# Altium schematic sheet Shutdown_2019_v1.1_4.SchDoc: Shutdown_2019_v1.1
size 453 x 301 mm; Date: 1/4/2019 10:42:19 PM; SheetNumber: 5; GateName_1: G$1; SymbolName_1: FRAME_B_L; LibraryName: frames; DeviceSetName: FRAME_B_L; GateName_2: G$2; SymbolName_2: DOCFIELD
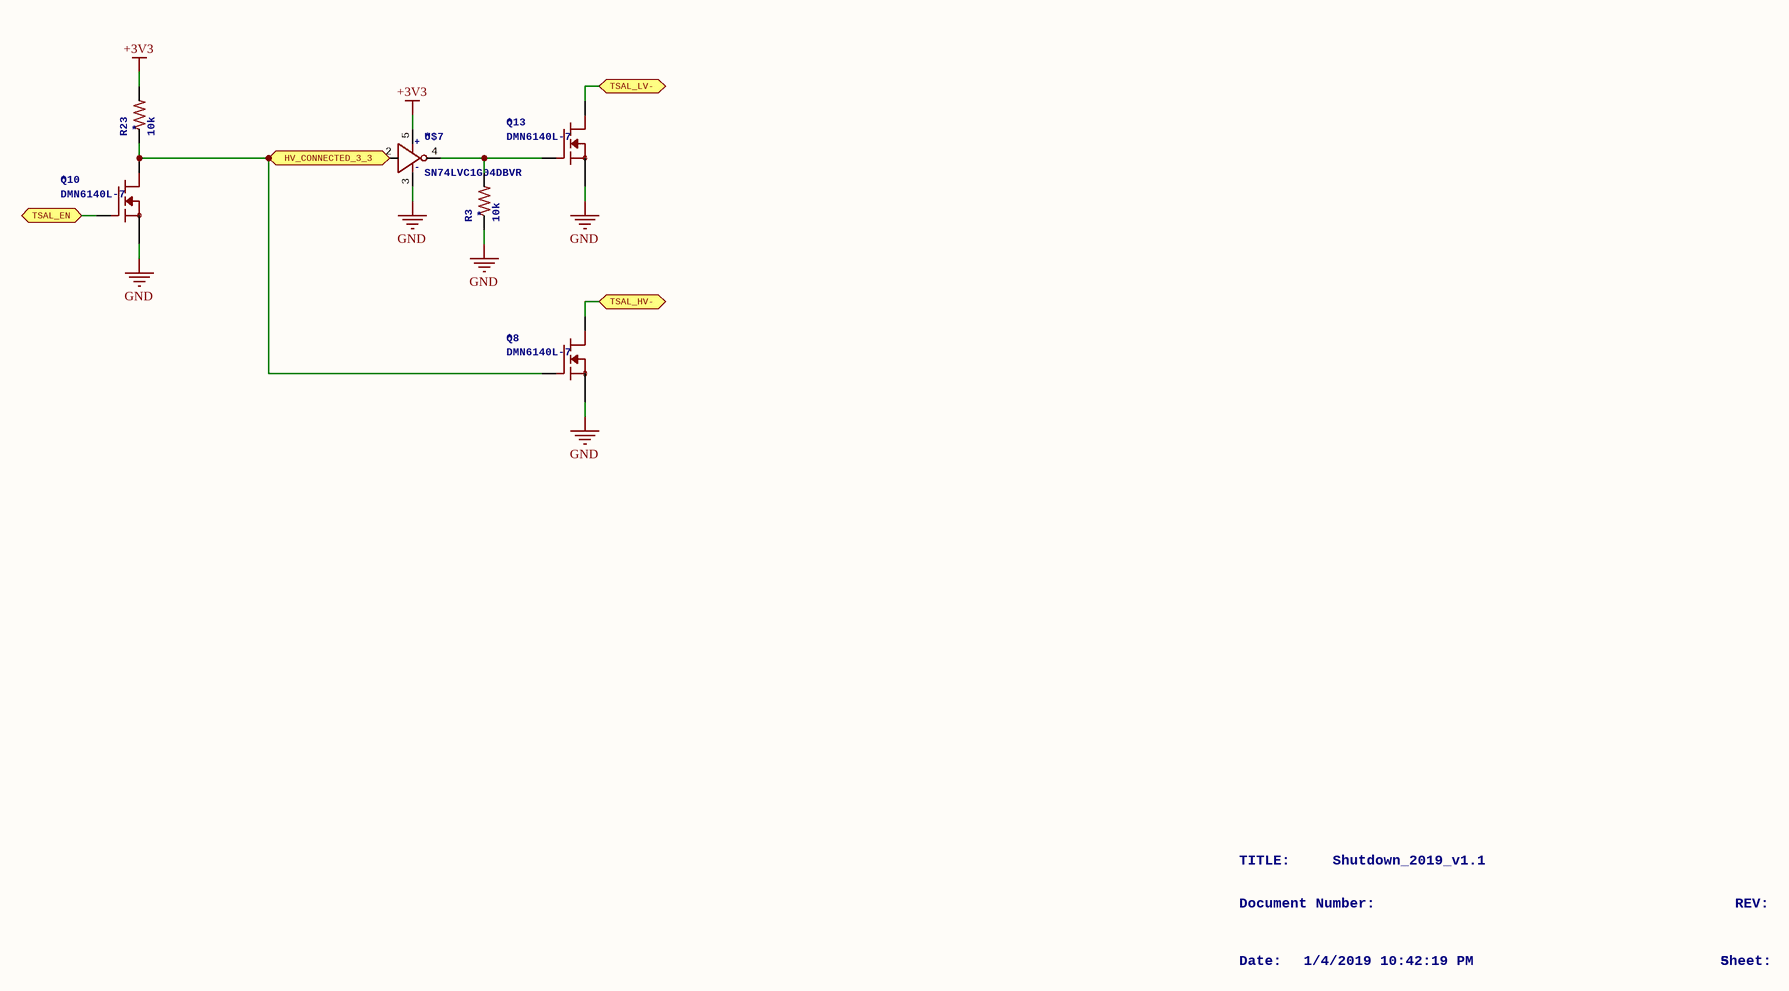
[diagram p0: Shutdown_2019_v1.1_4.SchDoc]

## Parts
Q8  DMN6140L-7  [SOT23]
Q10  DMN6140L-7  [SOT23]
Q13  DMN6140L-7  [SOT23]
R3  10k  [R0603]
R23  10k  [R0603]
U$7  SN74LVC1G04DBVR  [SOT23-5L]

## Ports
HV_CONNECTED_3_3, TSAL_EN, TSAL_HV-, TSAL_LV-

## Nets
+3V3: R23.2 U$7.5(V+)
GND: Q8.2(S) Q10.2(S) Q13.2(S) R3.1 U$7.3(GND)
HV_CONNECTED_3_3: Q8.1(G) Q10.3(D) R23.1 U$7.2(A) ; port HV_CONNECTED_3_3
TSAL_EN: Q10.1(G) ; port TSAL_EN
TSAL_HV-: Q8.3(D) ; port TSAL_HV-
TSAL_LV-: Q13.3(D) ; port TSAL_LV-
NetQ13_1: Q13.1(G) R3.2 U$7.4(Y)

## Notes on the sheet
- TITLE:
- Document Number:
- Shutdown_2019_v1.1
- REV:
- Date:
- 1/4/2019 10:42:19 PM
- Sheet:
- 5
- 1
- 2
- 3
- 4
- 6
- 7
- 8
- 9
- A
- B
- C
- D
- E
- F

## Library data of the parts
Q8 Q10 Q13 = DMN6140L-7: DMN6140L-7 Vgs(th) = 3V, Rds(on) = 140mOhm, Vds(max) = 60V; GateName_1: G$1; SymbolName_1: N-MOSFET-GDS; LibraryName: TRANS; DeviceSetName: DMN6140L-7; NAME: *
R3 R23 = R-US_R0603: RESISTOR, American symbol; GateName_1: G$1; SymbolName_1: R-US; DeviceSetName: R-US_; DeviceName: R0603; LibraryName: resistor; NAME: *
U$7 = SN74LVC1G04DBVR: TI Single Chip InverterSN74LVC1G04DBVRhttp://www.ti.com/lit/ds/symlink/sn74lvc1g04.pdf; GateName_1: G$1; SymbolName_1: INVERTER; LibraryName: Display_Custom; DeviceSetName: SN74LVC1G04DBVR; NAME: *; +: +; -: -